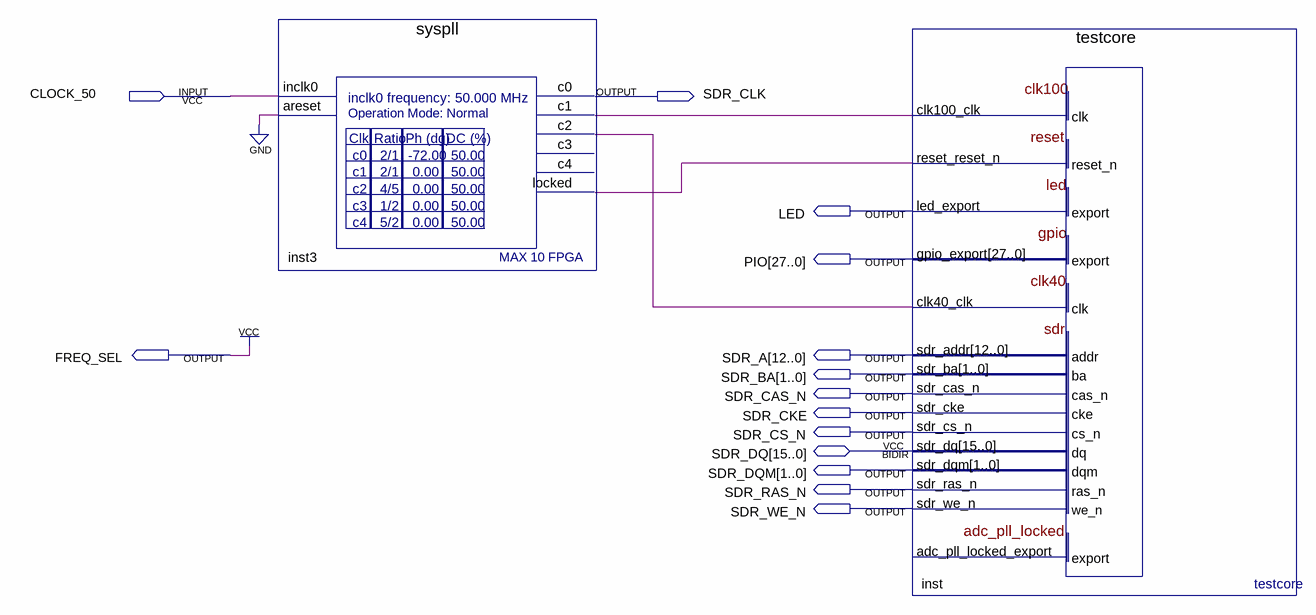
[diagram p0: schematic sheet]
// Quartus schematic niostest_top.bdf as structural Verilog: 2 symbols, 14 pins
module niostest_top (
  input  CLOCK_50,
  inout  [15:0] SDR_DQ,
  output SDR_CLK,
  output LED,
  output [27:0] PIO,
  output FREQ_SEL,
  output [12:0] SDR_A,
  output [1:0] SDR_BA,
  output SDR_CAS_N,
  output SDR_CKE,
  output SDR_CS_N,
  output [1:0] SDR_DQM,
  output SDR_RAS_N,
  output SDR_WE_N
);

  wire inst3_c1, inst3_c2, inst3_locked;

  syspll inst3 (
    .inclk0(CLOCK_50), .areset(1'b0), .c0(SDR_CLK), .c1(inst3_c1), .c2(inst3_c2), .locked(inst3_locked));  // open: c3, c4
  testcore inst (
    .clk100_clk(inst3_c1), .reset_reset_n(inst3_locked), .clk40_clk(inst3_c2), .led_export(LED),
    .sdr_addr(SDR_A), .sdr_ba(SDR_BA), .sdr_cas_n(SDR_CAS_N), .sdr_cke(SDR_CKE), .sdr_cs_n(SDR_CS_N),
    .sdr_dqm(SDR_DQM), .sdr_ras_n(SDR_RAS_N), .sdr_we_n(SDR_WE_N), .gpio_export(PIO), .sdr_dq(SDR_DQ));  // open: adc_pll_locked_export

  assign FREQ_SEL = 1'b1;
endmodule
